# Altium schematic sheet Camera.SchDoc: BluetoothGateway
size A; DrawnBy: Q.Thang & T.Khoa; Revision: V1.0.0; SheetNumber: 9; SheetTotal: 17
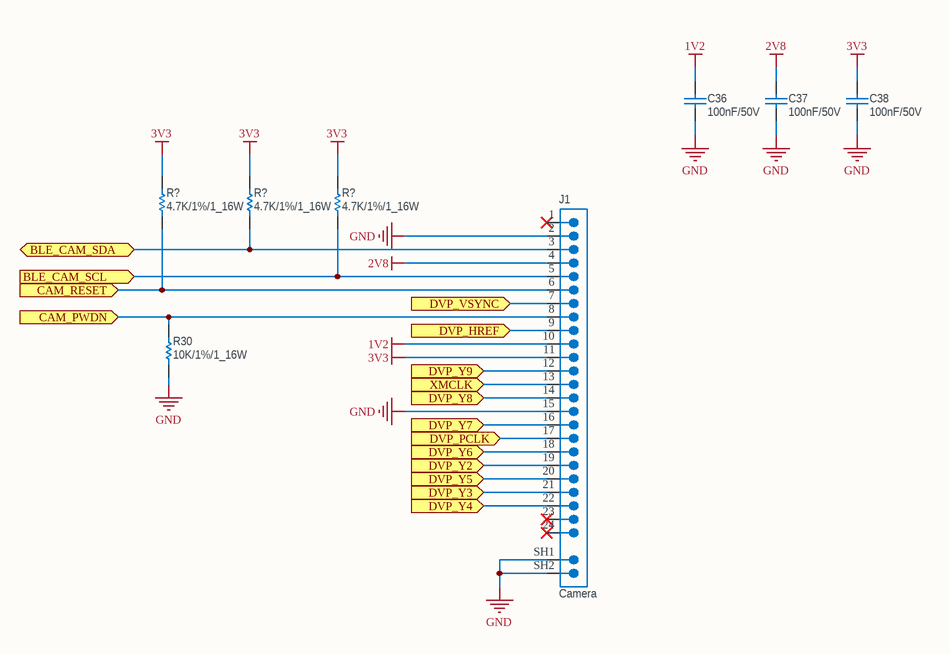
[diagram p0: Camera.SchDoc]

## Parts
(Parts that share a designator on the sheet are numbered #1, #2 ... from top to bottom, then left to right.)
C36  100nF/50V  [CAP_0402]
C37  100nF/50V  [CAP_0402]
C38  100nF/50V  [CAP_0402]
J1  Camera  [FPC_0.5mm_24P]
R30  10K/1%/1_16W  [RESISTOR_0402]
R?#1  4.7K/1%/1_16W  [RESISTOR_0402]
R?#2  4.7K/1%/1_16W  [RESISTOR_0402]
R?#3  4.7K/1%/1_16W  [RESISTOR_0402]

## Ports
BLE_CAM_SCL (in, see Overview_Schematic[3B], ESP32_BLE[3B]), BLE_CAM_SDA (bidir, see Overview_Schematic[3B], ESP32_BLE[2B]), CAM_PWDN (in, see Overview_Schematic[3B], ESP32_BLE[2B]), CAM_RESET (in, see Overview_Schematic[3B], ESP32_BLE[3B]), DVP_HREF (in, see Overview_Schematic[3B], ESP32_BLE[3B]), DVP_PCLK (in, see Overview_Schematic[3B], ESP32_BLE[2B]), DVP_VSYNC (in, see Overview_Schematic[3B], ESP32_BLE[2B]), DVP_Y2 (in, see Overview_Schematic[3B], ESP32_BLE[3A]), DVP_Y3 (in, see Overview_Schematic[3B], ESP32_BLE[2B]), DVP_Y4 (in, see Overview_Schematic[3B], ESP32_BLE[2B]), DVP_Y5 (in, see Overview_Schematic[3B], ESP32_BLE[3A]), DVP_Y6 (in, see Overview_Schematic[3B], ESP32_BLE[3B]), DVP_Y7 (in, see Overview_Schematic[3B], ESP32_BLE[2B]), DVP_Y8 (in, see Overview_Schematic[3B], ESP32_BLE[2B]), DVP_Y9 (in, see Overview_Schematic[3B], ESP32_BLE[2B]), XMCLK (in, see Overview_Schematic[3B], ESP32_BLE[2B])

## Nets
1V2: C36.2 J1.10
2V8: C37.2 J1.4
3V3: C38.2 J1.11 R?#1.2 R?#2.2 R?#3.2
GND: C36.1 C37.1 C38.1 J1.2 J1.15 J1.SH1(SHIELD) J1.SH2(SHIELD) R30.1
BLE_CAM_SCL: J1.5 R?#3.1 ; port BLE_CAM_SCL
BLE_CAM_SDA: J1.3 R?#2.1 ; port BLE_CAM_SDA
CAM_PWDN: J1.8 R30.2 ; port CAM_PWDN
CAM_RESET: J1.6 R?#1.1 ; port CAM_RESET
DVP_HREF: J1.9 ; port DVP_HREF
DVP_PCLK: J1.17 ; port DVP_PCLK
DVP_VSYNC: J1.7 ; port DVP_VSYNC
DVP_Y2: J1.19 ; port DVP_Y2
DVP_Y3: J1.21 ; port DVP_Y3
DVP_Y4: J1.22 ; port DVP_Y4
DVP_Y5: J1.20 ; port DVP_Y5
DVP_Y6: J1.18 ; port DVP_Y6
DVP_Y7: J1.16 ; port DVP_Y7
DVP_Y8: J1.14 ; port DVP_Y8
DVP_Y9: J1.12 ; port DVP_Y9
XMCLK: J1.13 ; port XMCLK

Not connected (* = marked no-connect by the designer): J1 1* 23* 24*

## Notes on the sheet
- Project Name
- Size
- A4
- Revision
- Checked By:
- Drawn By:
- Date:
- File:
- Last Modified:
- Sheet
- of

## Library data of the parts
C36-C38 = Ceramic_Cap_100nF_50V_0402: CAP, size 0402, 100nF, 50V; Supply Part Number: Tụ Gốm 0402 100nF (0.1uF) 50V; Supply Name: Thegioiic; Datasheet: *; Supply URL: https://www.thegioiic.com/tu-gom-0402-100nf-0-1uf-50v
J1 = FPC_0.5mm_24P: Cổng FPC 24 Chân 0.5mm Tiếp Điểm Trên, 0.4A 50V; Supply Name: Thegioiic; Supply Part Number: Cổng FPC 24 Chân 0.5mm Tiếp Điểm Trên; Supply URL: https://www.thegioiic.com/cong-fpc-24-chan-0-5mm-tiep-diem-tren
R30 = Res_10K_0402_1%: Resistor 0402 10KOhm 1% 1_16W; Supply Part Number: Điện Trở 10 KOhm 0402 1%; Supply Name: Thegioiic; Supply URL: https://www.thegioiic.com/dien-tro-10-kohm-0402-1-
R?#1-R?#3 = Res_4.7K_0402_1%: Resistor 0402 4.7KOhm 1% 1_16W; Supply Part Number: Điện Trở 4.7 KOhm 0402 1%; Supply Name: Thegioiic; Supply URL: https://www.thegioiic.com/dien-tro-4-7-kohm-0402-1-